# Altium schematic sheet Power.SchDoc
size A4; SheetNumber: 5; SheetTotal: 7; SPICEModelCacheJCDLMQBD: <root> / <DocumentId>JCDLMQBD</DocumentId> / </root>
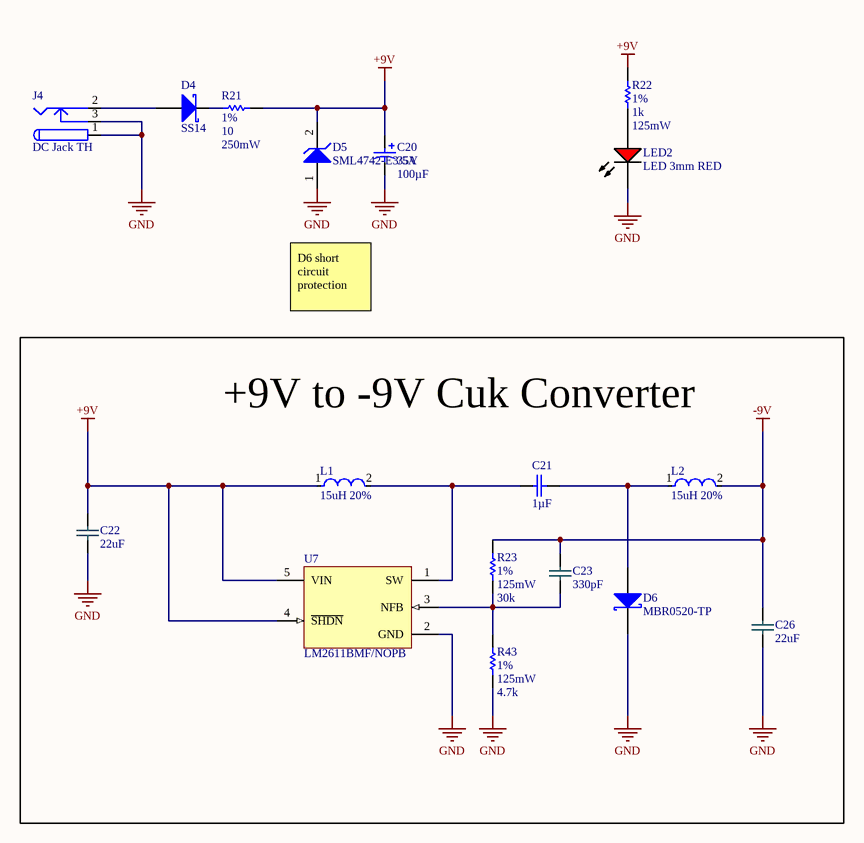
[diagram p0: Power.SchDoc]

## Parts
C20  Rated Voltage: 35V  Capacitance: 100µF  [E-CAP, SMT, diameter 6.3mm, height 7.7mm]  (hidden comment: Cap pol 100µF 35V)
C21  Capacitance: 1µF  [0805-CAP]  (hidden comment: Cap 1µF 0805 X7R)
C22  value 22uF  [1206-CAP]  (hidden comment: Cap 1206 22uF)
C23  value 330pF  [0603-CAP]  (hidden comment: Cap 0603 330pF)
C26  value 22uF  [1206-CAP]  (hidden comment: Cap 1206 22uF)
D4  SS14  [SS14]
D5  SML4742-E3/5A  [DO-214AC]
D6  MBR0520-TP  [SODFL370X135-2N]
J4  DC Jack TH  [DC_Jack]
L1  15uH 20%  [1210 SMD Cap]
L2  15uH 20%  [1210 SMD Cap]
LED2  LED 3mm RED  [KING-WP710A10QBCD_V]
R21  Tolerance (+-): 1%  Resistance: 10  Power: 250mW  [1206-RES]  (hidden comment: Res 10R 1% 1206)
R22  Tolerance (+-): 1%  Resistance: 1k  Power: 125mW  [0805-RES]  (hidden comment: Res 1k 1% 0805)
R23  Tolerance (+-): 1%  Power: 125mW  Resistance: 30k  [0805-RES]  (hidden comment: Res 30k 1% 0805)
R43  Tolerance (+-): 1%  Power: 125mW  Resistance: 4.7k  [0805-RES]  (hidden comment: Res 4.7k 1% 0805)
U7  LM2611BMF/NOPB  [DBV0005A_M]

## Blocks framed on the sheet
+9V to -9V Cuk Converter: C21-C23 C26 D6 L1 L2 R23 R43 U7

## Nets
+9V: C20.1 C22.2 D5.2 L1.1 R21.2 R22.2 U7.4(~{SHDN}) U7.5(VIN)
-9V: C23.2 C26.2 L2.2 R23.2
GND: C20.2 C22.1 C26.1 D5.1 D6.2(K) J4.1 J4.3 LED2.2(K) R43.2 U7.2(GND)
NetC21_1: C21.1 L1.2 U7.1(SW)
NetC21_2: C21.2 D6.1(A) L2.1
NetC23_1: C23.1 R23.1 R43.1 U7.3(NFB)
NetD4_A: D4.A J4.2
NetD4_K: D4.K R21.1
NetLED2_1: LED2.1(A) R22.1

## Notes on the sheet
- D6 short circuit protection

## Library data of the parts
C20 = CMP-00119-4: Cap Aluminum 100uF 35V ±20% (6.3x7.7mm) SMD 2000h 85°C; Lifetime @ Max. Temp. (hours): 2000h; - Tolerance: 20%; + Tolerance: 20%; Maximum operating temperature: 85°C
C21 = CMP-04113-3: Cap 1µF 0805 X7R 50V +-10%; Tolerance (+-): 10%; Dielectric: X7R; Maximum operating temperature: 125°C; Height: 1.45mm; Size (Imperial): 0805; Rated Voltage: 50V
C22 C26 = CMP-019-0043-11: 22uF, 25V, X5R, 20%; Source: main.SchLib; Mount: Surface Mount; Tolerance: 20%; Case/Package: 1206; Min Operating Temperature: -55°C; Voltage Rating: 25V; Length: 0.126inch; Voltage Rating (DC): 25V; Thickness: 0.02inch; Dielectric: X5R; Stock 1: 409; Packaging: Tape and Reel; Capacitance: 22uF; Case Code (Metric): 3216; RoHS: Yes; Width: 0.063inch; Max Operating Temperature: 85°C; Case Code (Imperial): 1206; Pricing 1: 1 = 0.72000, 10 = 0.51900, 50 = 0.51900, 100 = 0.34200, 1000 = 0.21500, 10000 = 0.15900 (USD); Design Item ID: Cap 1206 22uF
C23 = CMP-019-0066-14: 330pF,  5%,  50V,  C0G; Dielectric Material: Ceramic; Temperature Coefficient: 30ppm/°C; Dissipation Factor: 0.5%; Tolerance: 5%; REACH SVHC: No SVHC; RoHS: Yes; Contact Material: Tin; Height: 0.8mm; Package Quantity: 1; ComponentLink5URL: https://datasheet.ciiva.com/14597/70095383-14597551.pdf?src-supplier=Allied+Electronics; Width: 0.8mm; Lead Pitch: 0.7mm; ComponentLink2Description: https://datasheet.ciiva.com/14589/70095383-14589452.pdf?src-supplier=Allied+Electronics; Max Operating Temperature: 125°C; Radiation Hardening: No; Voltage Rating: 50V; Dielectric: C0G; ComponentLink4Description: https://datasheet.ciiva.com/7823/kem-c1003-c0g-smd-7823742.pdf?src-supplier=Element14; Case Code (Metric): 1608; ComponentLink2URL: https://datasheet.ciiva.com/14589/70095383-14589452.pdf?src-supplier=Allied+Electronics; Lead Free: Lead Free; Termination: SMD/SMT; Capacitance: 330pF; Stock 1: 158995; ComponentLink3Description: https://datasheet.ciiva.com/7823/kem-c1003-c0g-smd-7823741.pdf?src-supplier=Element14; Number of Pins: 2; Thickness: 0.034inch; Contact Plating: Tin,Matte; ComponentLink1Description: https://datasheet.ciiva.com/144/docfinderpartnumber-c0603c331j5gactu-144424.pdf?src-supplier=Digi-Key; ComponentLink5Description: https://datasheet.ciiva.com/14597/70095383-14597551.pdf?src-supplier=Allied+Electronics; Mount: Surface Mount,PCB; Packaging: Tape and Reel; ComponentLink4URL: https://datasheet.ciiva.com/7823/kem-c1003-c0g-smd-7823742.pdf?src-supplier=Element14; Pricing 1: 1=0,100000, 10=0,039000, 100=0,027000, 500=0,020000, 1000=0,016000, 4000=0,011000 (USD); Source: main.SchLib; ComponentLink3URL: https://datasheet.ciiva.com/7823/kem-c1003-c0g-smd-7823741.pdf?src-supplier=Element14; Design Item ID: Cap 0603 330pF; Depth: 0.8mm; Length: 1.6mm; Case Code (Imperial): 0603; Case/Package: 0603; Voltage: 50V; Min Operating Temperature: -55°C; Voltage Rating (DC): 50V; ComponentLink1URL: https://datasheet.ciiva.com/144/docfinderpartnumber-c0603c331j5gactu-144424.pdf?src-supplier=Digi-Key
D4 = CMP-029-0000-5: ON SEMICONDUCTOR - SS14 - DIODE, SCHOTTKY, 1A, 40V, DO-214AC-2; Manufacturer: ON Semiconductor / Fairchild; Forward Voltage: 500mV; Max Forward Surge Current (Ifsm): 40A; Polarity: Standard; Power Dissipation: 1.1W; Element Configuration: Single; Peak Reverse Current: 200uA; Number of Elements: 1; Average Rectified Current: 1A; ComponentLink2URL: https://datasheet.ciiva.com/8303/ss19-8303766.pdf?src-supplier=Avnet; Source: main.SchLib; Mount: Surface Mount; ComponentLink4URL: https://datasheet.ciiva.com/7965/1766303-7965241.pdf?src-supplier=Element14; Termination: SMD/SMT; Height: 2.2mm; Lead Free: Lead Free; Packaging: Tape and Reel; Max Reverse Voltage (DC): 40V; Voltage Rating (DC): 40V; REACH SVHC: No SVHC; ComponentLink7Description: https://datasheet.ciiva.com/910/ss12-910697.pdf?src-supplier=Digi-Key; Current: 1A; Number of Pins: 2; ComponentLink8Description: https://datasheet.ciiva.com/22651/1880990-22651980.pdf?src-supplier=Element14; Radiation Hardening: No; Case/Package: SMA; ComponentLink1URL: https://datasheet.ciiva.com/4713/ss14-197224-4713938.pdf?src-supplier=Mouser; Number of Terminals: 2; ComponentLink6Description: https://datasheet.ciiva.com/25951/ss19-25951496.pdf?src-supplier=Avnet+Europe; Manufacturer Part Number: SS14; ComponentLink1Description: https://datasheet.ciiva.com/4713/ss14-197224-4713938.pdf?src-supplier=Mouser; Forward Current: 1A; Max Repetitive Reverse Voltage (Vrrm): 40V; ComponentLink3URL: https://datasheet.ciiva.com/910/ss12-910695.pdf?src-supplier=Digi-Key; Max Operating Temperature: 125°C; Output Current: 1A; Peak Non-Repetitive Surge Current: 40A; Stock 1: 302709; ComponentLink6URL: https://datasheet.ciiva.com/25951/ss19-25951496.pdf?src-supplier=Avnet+Europe; ComponentLink2Description: https://datasheet.ciiva.com/8303/ss19-8303766.pdf?src-supplier=Avnet; Current Rating: 1A; ComponentLink3Description: https://datasheet.ciiva.com/910/ss12-910695.pdf?src-supplier=Digi-Key; Voltage: 40V; ComponentLink8URL: https://datasheet.ciiva.com/22651/1880990-22651980.pdf?src-supplier=Element14; Pricing 1: 1 = 0,42000, 10 = 0,29400, 50 = 0,29400, 100 = 0,13500, 1000 = 0,10400, 10000 = 0,08100 (USD); ComponentLink4Description: https://datasheet.ciiva.com/7965/1766303-7965241.pdf?src-supplier=Element14; Length: 4.75mm; ComponentLink7URL: https://datasheet.ciiva.com/910/ss12-910697.pdf?src-supplier=Digi-Key; Min Operating Temperature: -65°C; Max Power Dissipation: 1.1W; Design Item ID: SS14; ComponentLink5URL: https://datasheet.ciiva.com/910/ss12-910696.pdf?src-supplier=Digi-Key; Width: 2.95mm; RoHS: Yes; ComponentLink5Description: https://datasheet.ciiva.com/910/ss12-910696.pdf?src-supplier=Digi-Key; Weight: 0.003739oz; Package Quantity: 7500
D5 = CMP-029-0015-3: 12V Zener; Manufacturer: Vishay Semiconductors; Impedance: 9R; Power Dissipation: 1W; Tolerance: 10%; Element Configuration: Single; Max Reverse Leakage Current: 5uA; ComponentLink3Description: http://www.vishay.com/docs/85782/sml4728.pdf?src-supplier=Avnet; Package Quantity: 7500; Source: main.SchLib; ComponentLink2Description: http://www.mouser.com/ds/2/427/sml4728-67952.pdf?src-supplier=Mouser; Manufacturer Part Number: SML4742-E3/5A; Mount: Surface Mount; RoHS: Yes; Max Power Dissipation: 1W; Number of Pins: 2; ComponentLink1URL: https://media.digikey.com/pdf/Data%20Sheets/Vishay%20Siliconix%20PDFs/SML4728-SML4764A.pdf?src-supplier=Digi-Key; Radiation Hardening: No; ComponentLink1Description: https://media.digikey.com/pdf/Data%20Sheets/Vishay%20Siliconix%20PDFs/SML4728-SML4764A.pdf?src-supplier=Digi-Key; Stock 1: 7485; ComponentLink2URL: http://www.mouser.com/ds/2/427/sml4728-67952.pdf?src-supplier=Mouser; Packaging: Tape and Reel; Voltage Tolerance: 10%; Min Operating Temperature: -65°C; Pricing 1: 1 = 0,50000, 10 = 0,42600, 25 = 0,39760, 100 = 0,31800, 250 = 0,29524, 500 = 0,24982, 1000 = 0,19305, 2500 = 0,17602 (USD); Case/Package: SMA; Design Item ID: SML4742-E3/5A; Zener Voltage: 12V; Mouser part: 78-SML4742-E3/5A; ComponentLink3URL: http://www.vishay.com/docs/85782/sml4728.pdf?src-supplier=Avnet; Max Operating Temperature: 150°C
D6 = CMP-055-0006-A.3: Rectifier Diode, Schottky, 1 Phase, 1 Element, 0.5A, 20V V(RRM), Silicon
J4 = CMP-034-0002-1: Low Voltage Power Supply Connector; Darkglass part: D00-0019; Selective Soldering: Yes; ComponentLink1Description: Manufacturer Link; Design Item ID: DC Jack TH; Source: main.SchLib; ComponentLink1URL: http://domino.kycon.com/internet/Products.html; Supplied by Darkglass: Yes
L1 L2 = CMP-027-0005-1: Fixed Inductors 15uH 20% 0.48ohm 0.98A AEC-Q200
LED2 = CMP-036-0000-2: THT LED round mono-color waterclear, WL-TMRW , RED; PartNumber: 151034rs03000; Manufacturer: Wuerth Elektronik; Darkglass part: D00-0042; Available Preview Images: 2D; Selective Soldering: YES; ComponentLink2URL: http://katalog.we-online.de/pbs/datasheet/7448042001.pdfhttp://katalog.we-online.de/pbs/datasheet/7448042001.pdfhttp://katalog.we-online.de/pbs/datasheet/7448042001.pdfhttp://katalog.we-online.de/pbs/datasheet/151033BS03000.pdf; Fitted: Fitted; Emitting color: RED; ComponentLink1URL: http://www.we-online.com; Design Item ID: LED 3mm RED; Supplied by Darkglass: YES; Source: main.SchLib; ComponentLink1Description: Manufacturer URL; Mouser part: 710-151034RS03000; PackageReference: Type 3mm; ComponentLink2Description: Datasheet; Darkglass: D00-0042
R21 = CMP-02882-2: Resistor 10R +-1% 1206 Thin film 0.25W +-50ppm/°C; Temperature Coefficient (ppm/°C): 50; Maximum working voltage: 200V; Composition: Thin film; Size (Imperial): 1206
R22 = CMP-02472-2: Resistor 1k +-1% 0805 Thin film 0.125W +-50ppm/°C; Temperature Coefficient (ppm/°C): 50; Maximum working voltage: 150V; Composition: Thin film; Size (Imperial): 0805
R23 = CMP-02638-2: Resistor 30k +-1% 0805 Thin film 0.125W +-50ppm/°C; Maximum working voltage: 150V; Temperature Coefficient (ppm/°C): 50; Composition: Thin film; Size (Imperial): 0805
R43 = CMP-02548-2: Resistor 4.7k +-1% 0805 Thin film 0.125W +-50ppm/°C; Temperature Coefficient (ppm/°C): 50; Maximum working voltage: 150V; Composition: Thin film; Size (Imperial): 0805
U7 = CMP-0069-01166-3: 1.4MHz Cuk Converter, 5-pin SOT-23, Pb-Free; Manufacturer: Texas Instruments; PackageTopMarking: S40B*XTT; PowerWise: N; CompType: Switcher; ComponentLink1URL: http://www.ti.com/general/docs/lit/getliterature.tsp?genericPartNumber=LM2611&fileType=pdf; RoHS: Y; PinCount: 5; PackageReference: DBV0005A; PackageDescription: Molded SOT-23, .115 x .063 x .040 in Body, 5 Lead, .0375 in Pitch; ComponentLink1Description: Datasheet URL